# Altium schematic sheet Bin_C_Box.SchDoc
size A
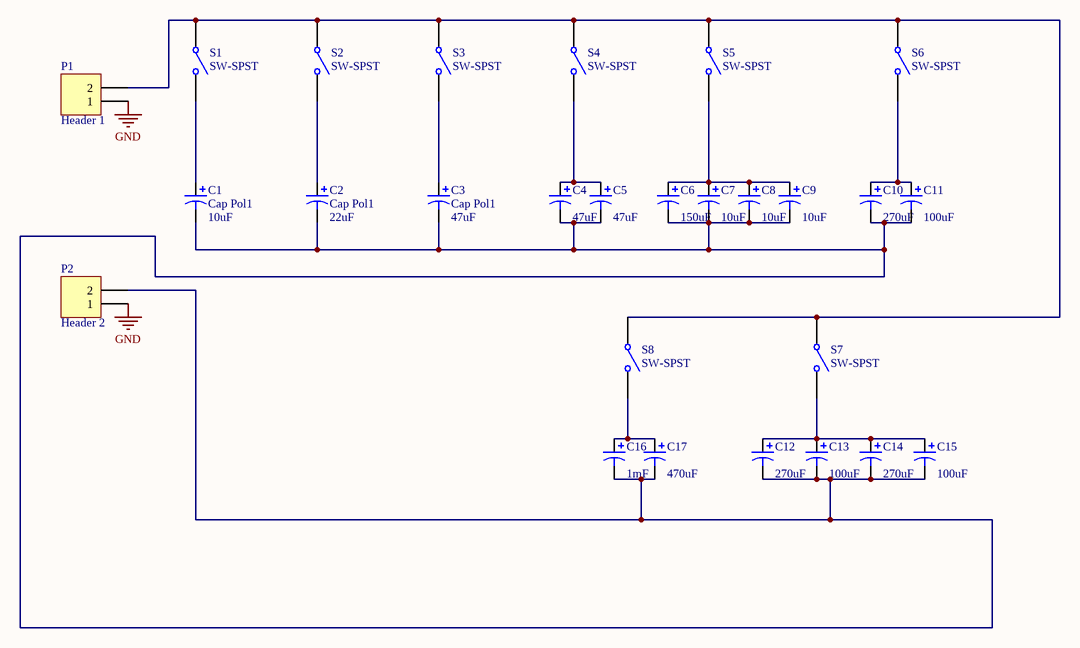
[diagram p0: Bin_C_Box.SchDoc]

## Parts
C1  Cap Pol1  value 10uF  [CAP_2_5]
C2  Cap Pol1  value 22uF  [CAP_2_5]
C3  Cap Pol1  value 47uF  [CAP_3_8]
C4  value 47uF  [CAP_3_8]  (hidden comment: Cap Pol1)
C5  value 47uF  [CAP_3_8]
C6  value 150uF  [CAP_5_13]
C7  value 10uF  [CAP_2_5]
C8  value 10uF  [CAP_2_5]  (hidden comment: Cap Pol1)
C9  value 10uF  [CAP_2_5]
C10  value 270uF  [CAP_5_13]  (hidden comment: Cap Pol1)
C11  value 100uF  [CAP_3_8]  (hidden comment: Cap Pol1)
C12  value 270uF  [CAP_5_13]  (hidden comment: Cap Pol1)
C13  value 100uF  [CAP_3_8]  (hidden comment: Cap Pol1)
C14  value 270uF  [CAP_5_13]  (hidden comment: Cap Pol1)
C15  value 100uF  [CAP_3_8]  (hidden comment: Cap Pol1)
C16  value 1mF  [CAP_5_13]  (hidden comment: Cap Pol1)
C17  value 470uF  [CAP_5_13]  (hidden comment: Cap Pol1)
P1  Header 1  [Header Block]
P2  Header 2  [Header Block]
S1  SW-SPST  [SPST]
S2  SW-SPST  [SPST]
S3  SW-SPST  [SPST]
S4  SW-SPST  [SPST]
S5  SW-SPST  [SPST]
S6  SW-SPST  [SPST]
S7  SW-SPST  [SPST]
S8  SW-SPST  [SPST]

## Nets
GND: P1.1 P2.1
NetC1_1: C1.1 S1.2(NO)
NetC1_2: C1.2 C2.2 C3.2 C4.2 C5.2 C6.2 C7.2 C8.2 C9.2 C10.2 C11.2 C12.2 C13.2 C14.2 C15.2 C16.2 C17.2 P2.2
NetC2_1: C2.1 S2.2(NO)
NetC3_1: C3.1 S3.2(NO)
NetC4_1: C4.1 C5.1 S4.2(NO)
NetC6_1: C6.1 C7.1 C8.1 C9.1 S5.2(NO)
NetC10_1: C10.1 C11.1 S6.2(NO)
NetC12_1: C12.1 C13.1 C14.1 C15.1 S7.2(NO)
NetC16_1: C16.1 C17.1 S8.2(NO)
NetP1_2: P1.2 S1.1(COMMON) S2.1(COMMON) S3.1(COMMON) S4.1(COMMON) S5.1(COMMON) S6.1(COMMON) S7.1(COMMON) S8.1(COMMON)

## Library data of the parts
C1-C17 = Cap Pol1: Polarized Capacitor (Radial); Published: 8-Jun-2000; LatestRevisionDate: 17-Jul-2002; LatestRevisionNote: Re-released for DXP Platform.; PackageReference: RB7.6-15; Publisher: Altium Limited
P1 P2 = Header 2: Header, 2-Pin; LatestRevisionDate: 17-Jul-2002; LatestRevisionNote: Re-released for DXP Platform.; Publisher: Altium Limited
S1-S8 = SW-SPST: Single-Pole, Single-Throw Switch; Published: 24-Mar-1999; LatestRevisionDate: 17-Jul-2002; LatestRevisionNote: Re-released for DXP Platform.; PackageReference: SPST-2; Publisher: Altium Limited